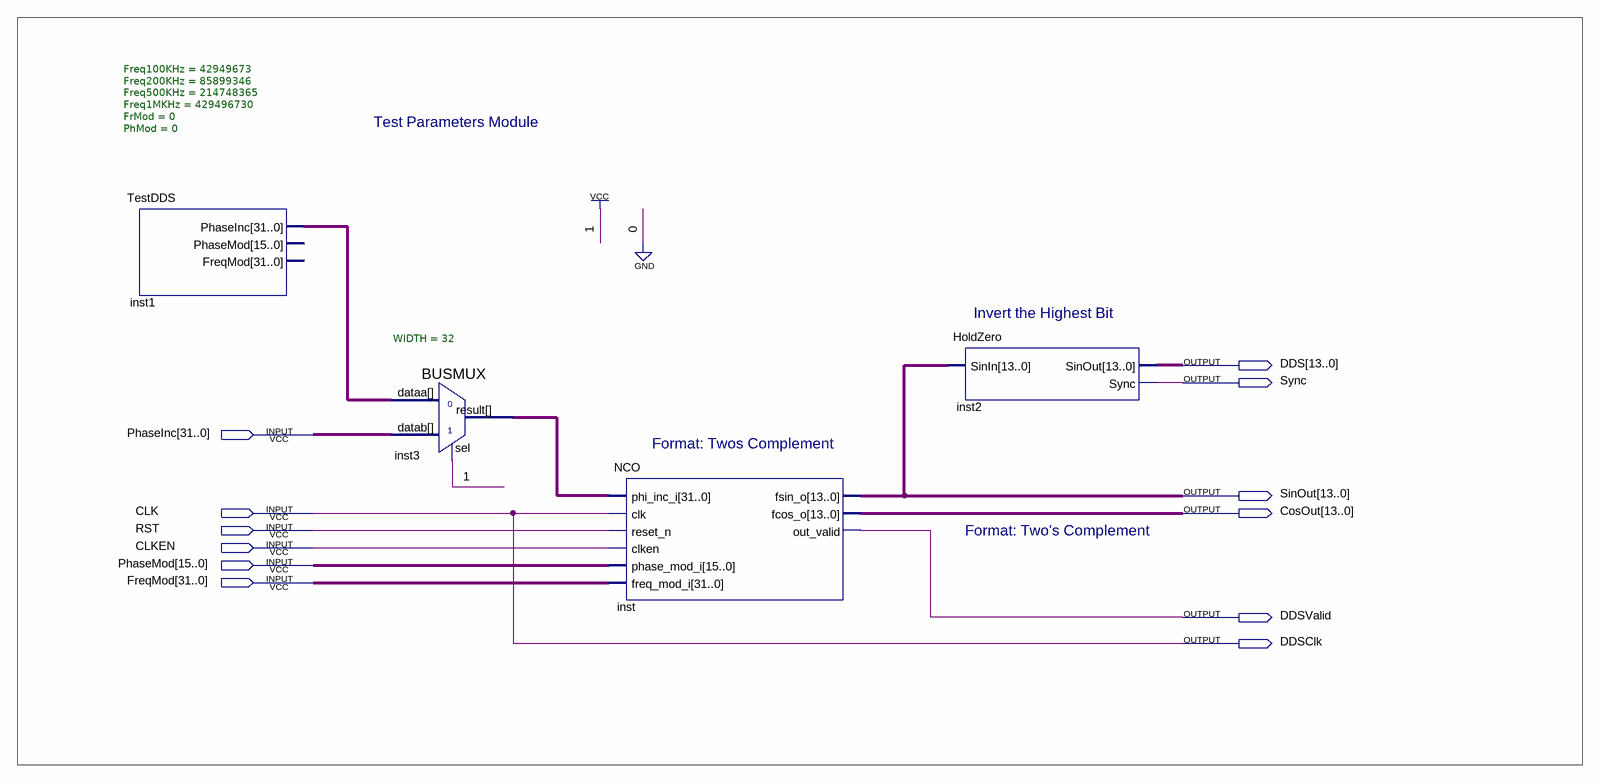
[diagram p0: schematic sheet]
// Quartus schematic DDS.bdf as structural Verilog: 4 symbols, 12 pins
module DDS (
  input  [31:0] PhaseInc,
  input  CLK,
  input  RST,
  input  CLKEN,
  input  [15:0] PhaseMod,
  input  [31:0] FreqMod,
  output [13:0] DDS,
  output Sync,
  output [13:0] SinOut,
  output [13:0] CosOut,
  output DDSValid,
  output DDSClk
);

  wire [31:0] inst1_phaseinc, inst3_result;

  TestDDS #(.Freq100KHz(42949673), .Freq200KHz(85899346), .Freq500KHz(214748365), .Freq1MKHz(429496730), .FrMod(0), .PhMod(0)) inst1 (.PhaseInc(inst1_phaseinc));  // open: PhaseMod, FreqMod
  BUSMUX #(.WIDTH(32)) inst3 (.datab(PhaseInc), .sel(1'b1), .dataa(inst1_phaseinc), .result(inst3_result));
  NCO inst (
    .phi_inc_i(inst3_result), .clk(CLK), .reset_n(RST), .clken(CLKEN), .phase_mod_i(PhaseMod),
    .freq_mod_i(FreqMod), .fsin_o(SinOut), .fcos_o(CosOut), .out_valid(DDSValid));
  HoldZero inst2 (.SinIn(SinOut), .SinOut(DDS), .Sync(Sync));

  assign DDSClk = CLK;

  // Notes on the sheet:
  //   Test Parameters Module
  //   Invert the Highest Bit
  //   Format: Twos Complement
  //   Format: Two's Complement
endmodule
